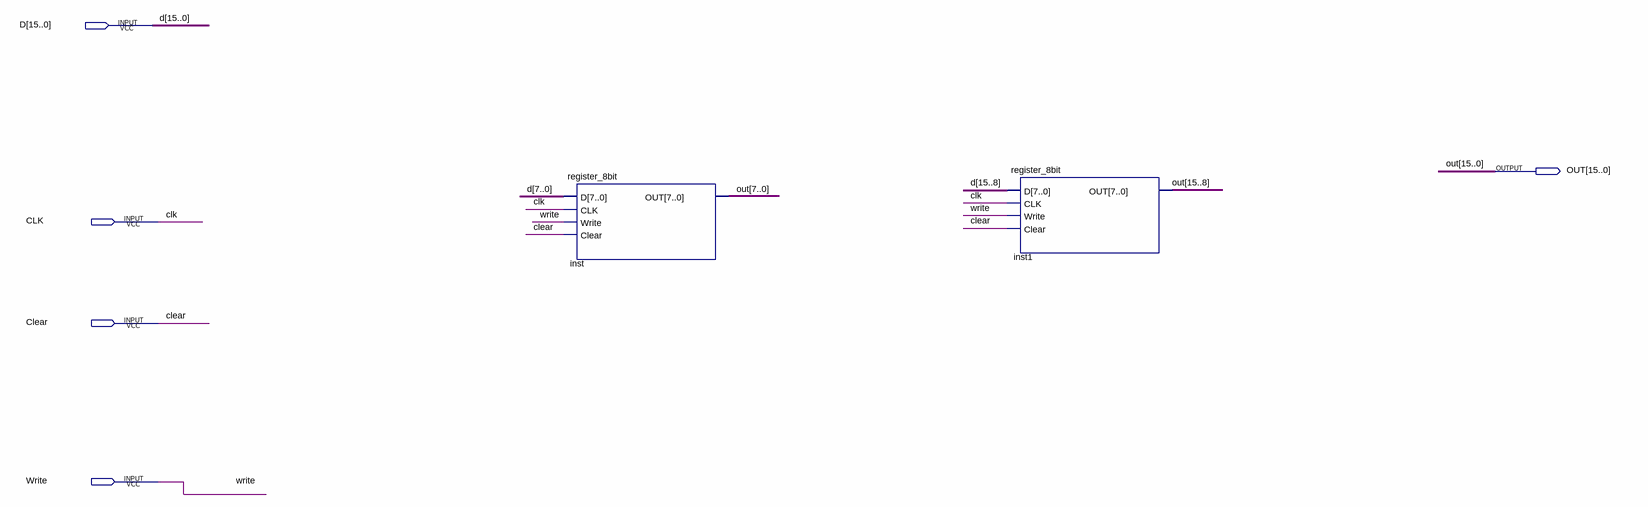
[diagram p0: schematic sheet]
// Quartus schematic reg_16bit.bdf as structural Verilog: 2 symbols, 5 pins
module reg_16bit (
  input  [15:0] D,
  input  CLK,
  input  Clear,
  input  Write,
  output [15:0] OUT
);

  register_8bit inst (.D(D[7:0]), .CLK(CLK), .Write(Write), .Clear(Clear), .OUT(OUT[7:0]));
  register_8bit inst1 (.D(D[15:8]), .CLK(CLK), .Write(Write), .Clear(Clear), .OUT(OUT[15:8]));
endmodule
